# Altium schematic sheet Final Schematic.SchDoc
size A3; SheetNumber: 1; SheetTotal: 1
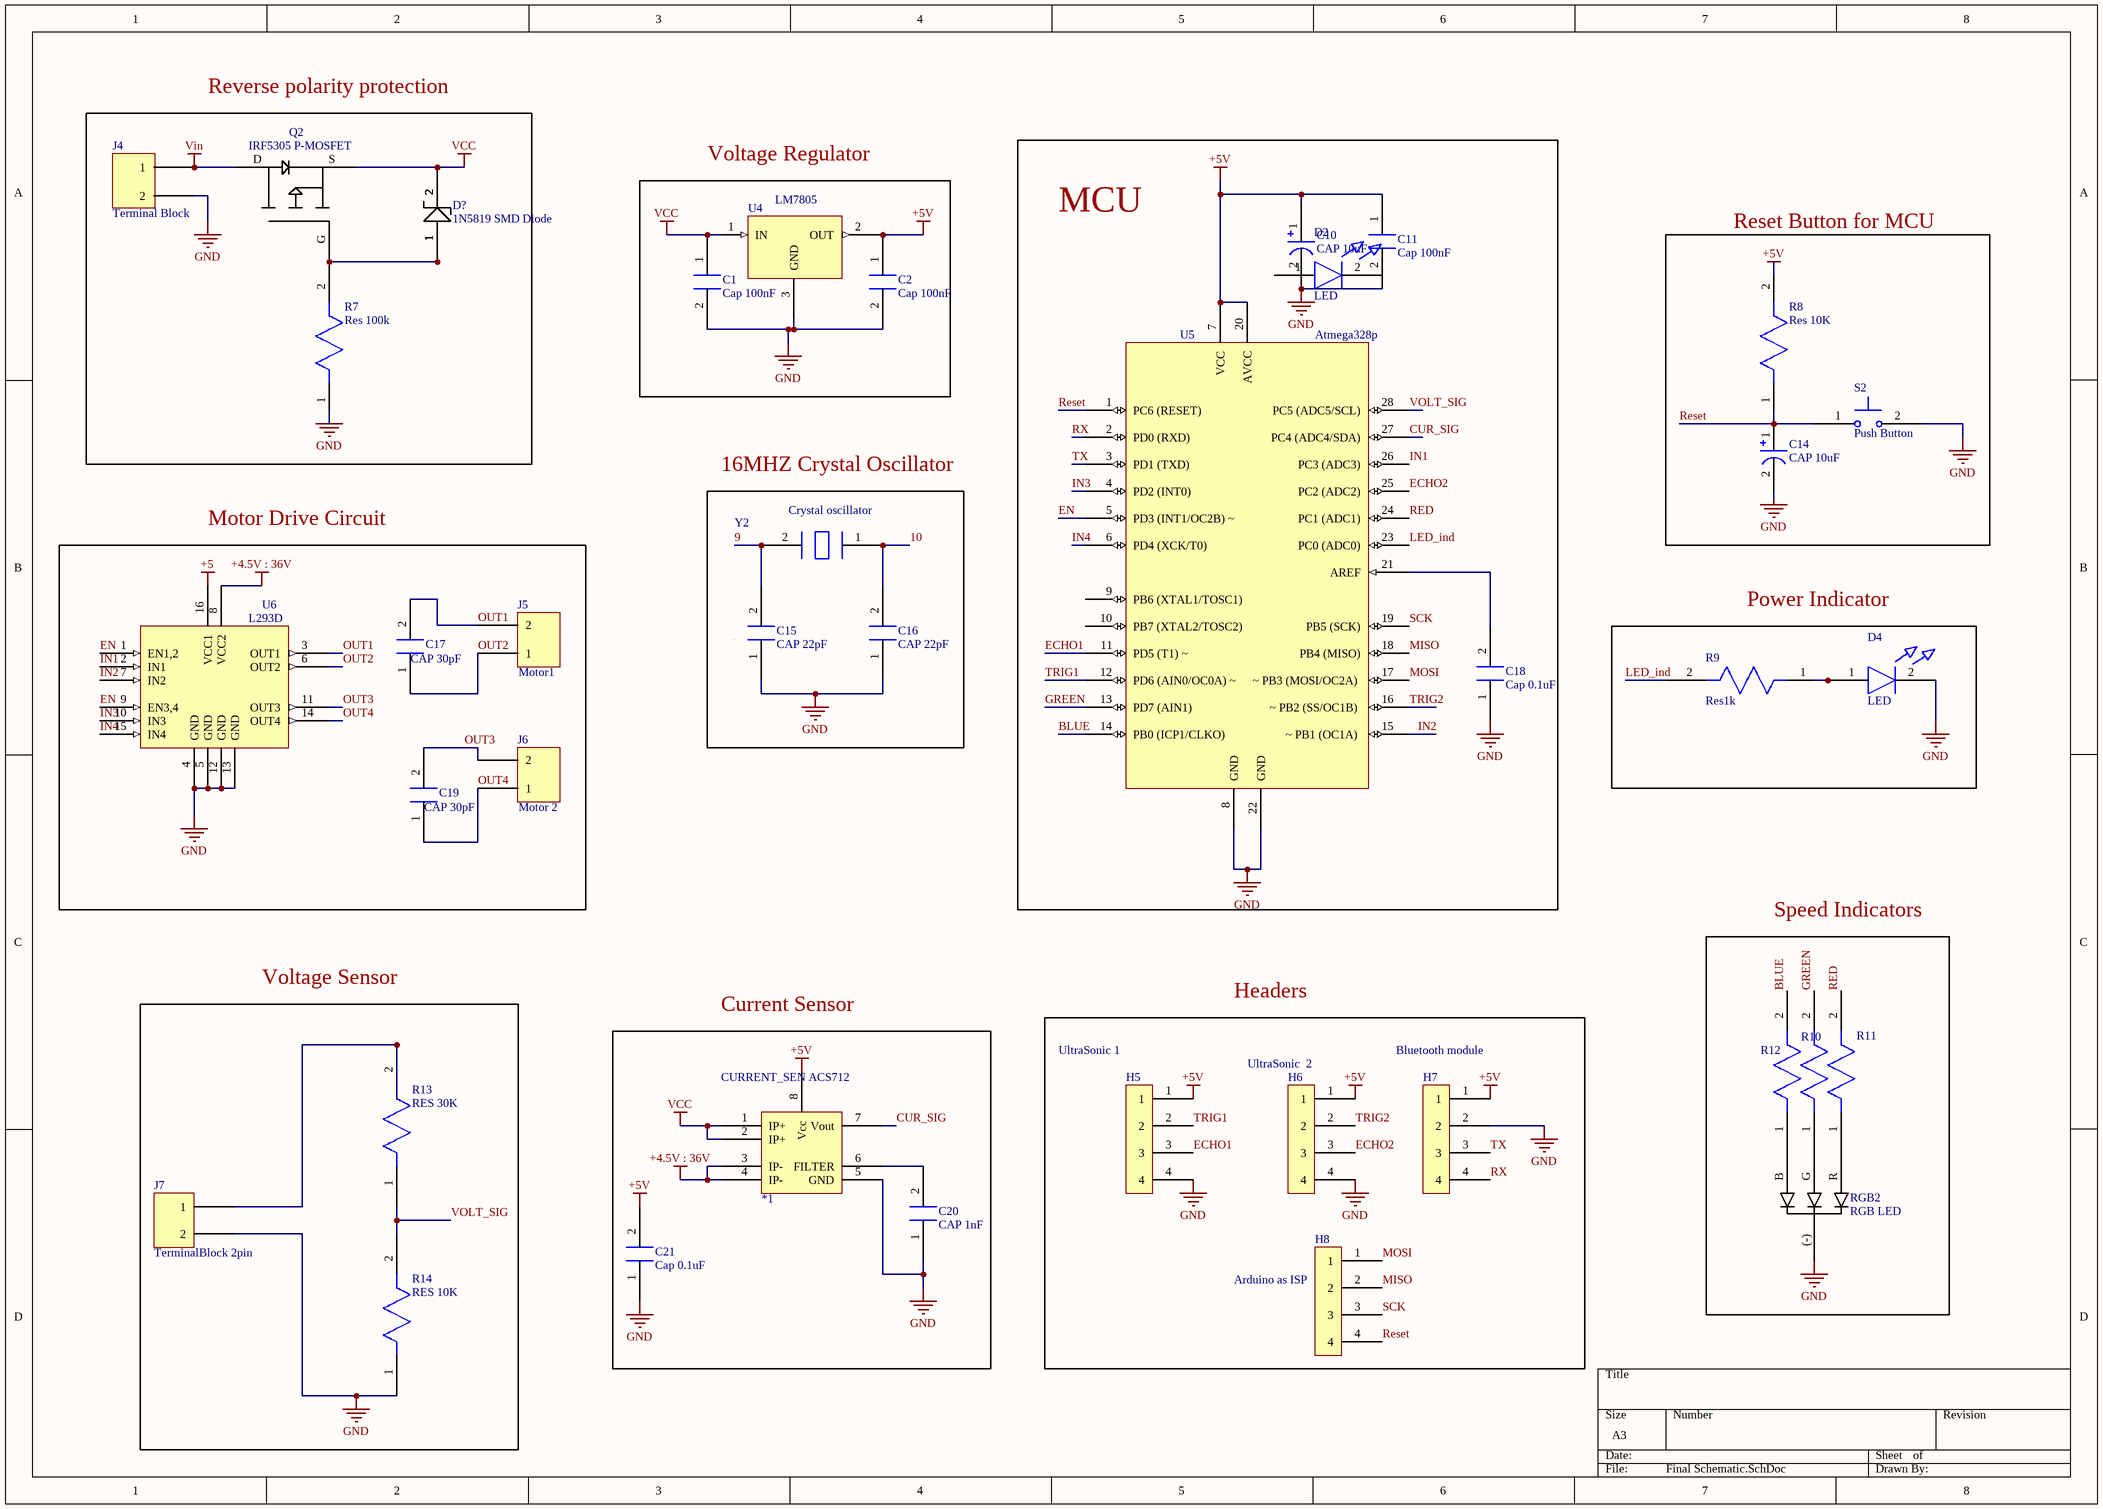
[diagram p0: Final Schematic.SchDoc]

## Parts
*1  CURRENT_SEN ACS712  [Cuurent_sens]
C1  Cap 100nF
C2  Cap 100nF
C10  CAP 10uF  [Cap 10uF]
C11  Cap 100nF
C14  CAP 10uF  [Cap 10uF]
C15  CAP 22pF  [Cap 22pF]
C16  CAP 22pF  [Cap 22pF]
C17  CAP 30pF
C18  Cap 0.1uF
C19  CAP 30pF
C20  CAP 1nF  [CAP 1nF]
C21  Cap 0.1uF  [CAP 0.1uF]
D2  LED  [LED]
D4  LED  [LED]
D?  1N5819 SMD Diode  [Test]
H5  UltraSonic 1  [Header 4pin]
H6  UltraSonic  2  [Header 4pin]
H7  Bluetooth module  [Header 4pin]
H8  Arduino as ISP  [Header 4pin]
J4  Terminal Block  [Terminal Block 2pin]
J5  Motor1  [Terminal Block 2pin]
J6  Motor 2  [Terminal Block 2pin]
J7  TerminalBlock 2pin  [Terminal Block 2pin]
Q2  IRF5305 P-MOSFET  [IRF5305]
R7  Res 100k  [Res100K]
R8  Res 10K  [Res10K]
R9  Res1k  [Res 1K]
R10  Resistor  (value not drawn)
R11  Resistor  (value not drawn)
R12  Resistor  (value not drawn)
R13  RES 30K  [Res100K]
R14  RES 10K  [Res10K]
RGB2  RGB LED  [RGB LED]
S2  Push Button  [Push Button]
U4  LM7805  [LM7805]
U5  Atmega328p  [ATMega 328 P-PU - duplicate]
U6  L293D  [L293D]
Y2  Crystal oscillator  [Crrystal 16MHZ]

## Blocks framed on the sheet
Reverse polarity protection: D? J4 Q2 R7
MCU: C10 C11 C18 D2 U5
Voltage Regulator: C1 C2 U4
Reset Button for MCU: C14 R8 S2
16MHZ Crystal Oscillator: C15 C16 Y2
Motor Drive Circuit: C17 C19 J5 J6 U6
Power Indicator: D4 R9
Speed Indicators: R10-R12 RGB2
Voltage Sensor: J7 R13 R14
Current Sensor: *1 C20 C21
Headers: H5-H8

## Nets
+4.5V : 36V: *1.3(IP-) *1.4(IP-) U6.8(VCC2)
+5: U6.16(VCC1)
+5V: *1.8(Vcc) C2.1 C10.1 C11.1 C21.2 H5.1 H6.1 H7.1 R8.2 U4.2(OUT) U5.7(VCC) U5.20(AVCC)
GND: *1.5(GND) C1.2 C2.2 C10.2 C11.2 C14.2 C15.1 C16.1 C18.1 C20.1 C21.1 D4.2 H5.4 H6.4 H7.2 J4.2 J7.2 R7.1 R14.1 RGB2.(-) S2.2 U4.3(GND) U5.8(GND) U5.22(GND) U6.4(GND) U6.5(GND) U6.12(GND) U6.13(GND)
VCC: *1.1(IP+) *1.2(IP+) C1.1 D?.2 Q2.S U4.1(IN)
Vin: J4.1 Q2.D
9: C15.2 Y2.2
10: C16.2 Y2.1
BLUE: R12.2 U5.14(PB0_(ICP1/CLKO))
CUR_SIG: *1.7(Vout) U5.27(PC4_(ADC4/SDA))
ECHO1: H5.3 U5.11(PD5_(T1)_~)
ECHO2: H6.3 U5.25(PC2_(ADC2))
EN: U5.5(PD3_(INT1/OC2B)_~) U6.1(EN1,2) U6.9(EN3,4)
GREEN: R10.2 U5.13(PD7_(AIN1))
IN1: U5.26(PC3_(ADC3)) U6.2(IN1)
IN2: U5.15(~_PB1_(OC1A)) U6.7(IN2)
IN3: U5.4(PD2_(INT0)) U6.10(IN3)
IN4: U5.6(PD4_(XCK/T0)) U6.15(IN4)
LED_ind: R9.2 U5.23(PC0_(ADC0))
MISO: H8.2 U5.18(PB4_(MISO))
MOSI: H8.1 U5.17(~_PB3_(MOSI/OC2A))
OUT1: C17.2 J5.2 U6.3(OUT1)
OUT2: C17.1 J5.1 U6.6(OUT2)
OUT3: C19.2 J6.2 U6.11(OUT3)
OUT4: C19.1 J6.1 U6.14(OUT4)
RED: R11.2 U5.24(PC1_(ADC1))
Reset: C14.1 H8.4 R8.1 S2.1 U5.1(PC6_(RESET))
RX: H7.4 U5.2(PD0_(RXD))
SCK: H8.3 U5.19(PB5_(SCK))
TRIG1: H5.2 U5.12(PD6_(AIN0/OC0A)_~)
TRIG2: H6.2 U5.16(~_PB2_(SS/OC1B))
TX: H7.3 U5.3(PD1_(TXD))
VOLT_SIG: R13.1 R14.2 U5.28(PC5_(ADC5/SCL))
Net*1_6: *1.6(FILTER) C20.2
NetC18_2: C18.2 U5.21(AREF)
NetD4_1: D4.1 R9.1
NetD?_1: D?.1 Q2.G R7.2
NetJ7_1: J7.1 R13.2
NetR10_1: R10.1 RGB2.G
NetR11_1: R11.1 RGB2.R
NetR12_1: R12.1 RGB2.B

Not connected (* = marked no-connect by the designer): D2 1(7) 2(6); U5 9(PB6_(XTAL1/TOSC1)) 10(PB7_(XTAL2/TOSC2))

## Library data of the parts
*1 = CURRENT_MOD ACS712
H5-H8 = Headers 4pin_1
J5 J6 = Terminal Block
R13 = RES 100K
J7 = TerminalBlock 2pin: Mfr number: *; Parameter 2: *; Parameter 3: *; Parameter 4: *